# Altium schematic sheet 2-EXS82.SchDoc
size 594 x 420 mm; SheetNumber: 2; SheetTotal: 7; PageSetup: Record=PageOptions|CenterHorizontal=False|CenterVertical=False|PrintScale=0.43|XCorrection=0.00|YCorrection=0.00|PrintKind=1|BorderSize=5000000|LeftOffset=0|BottomOffset=0|Orientation=2|PaperLength=5940|PaperWidth=4200|Scale=100|PaperSource=7|PrintQuality=-4|MediaType=1|DitherType=10|PaperKind=Personal. 1: 215,9 x 279,4 mm|PrintScaleMode=0; NumTotalFolhas: 7; NumFolha: 2
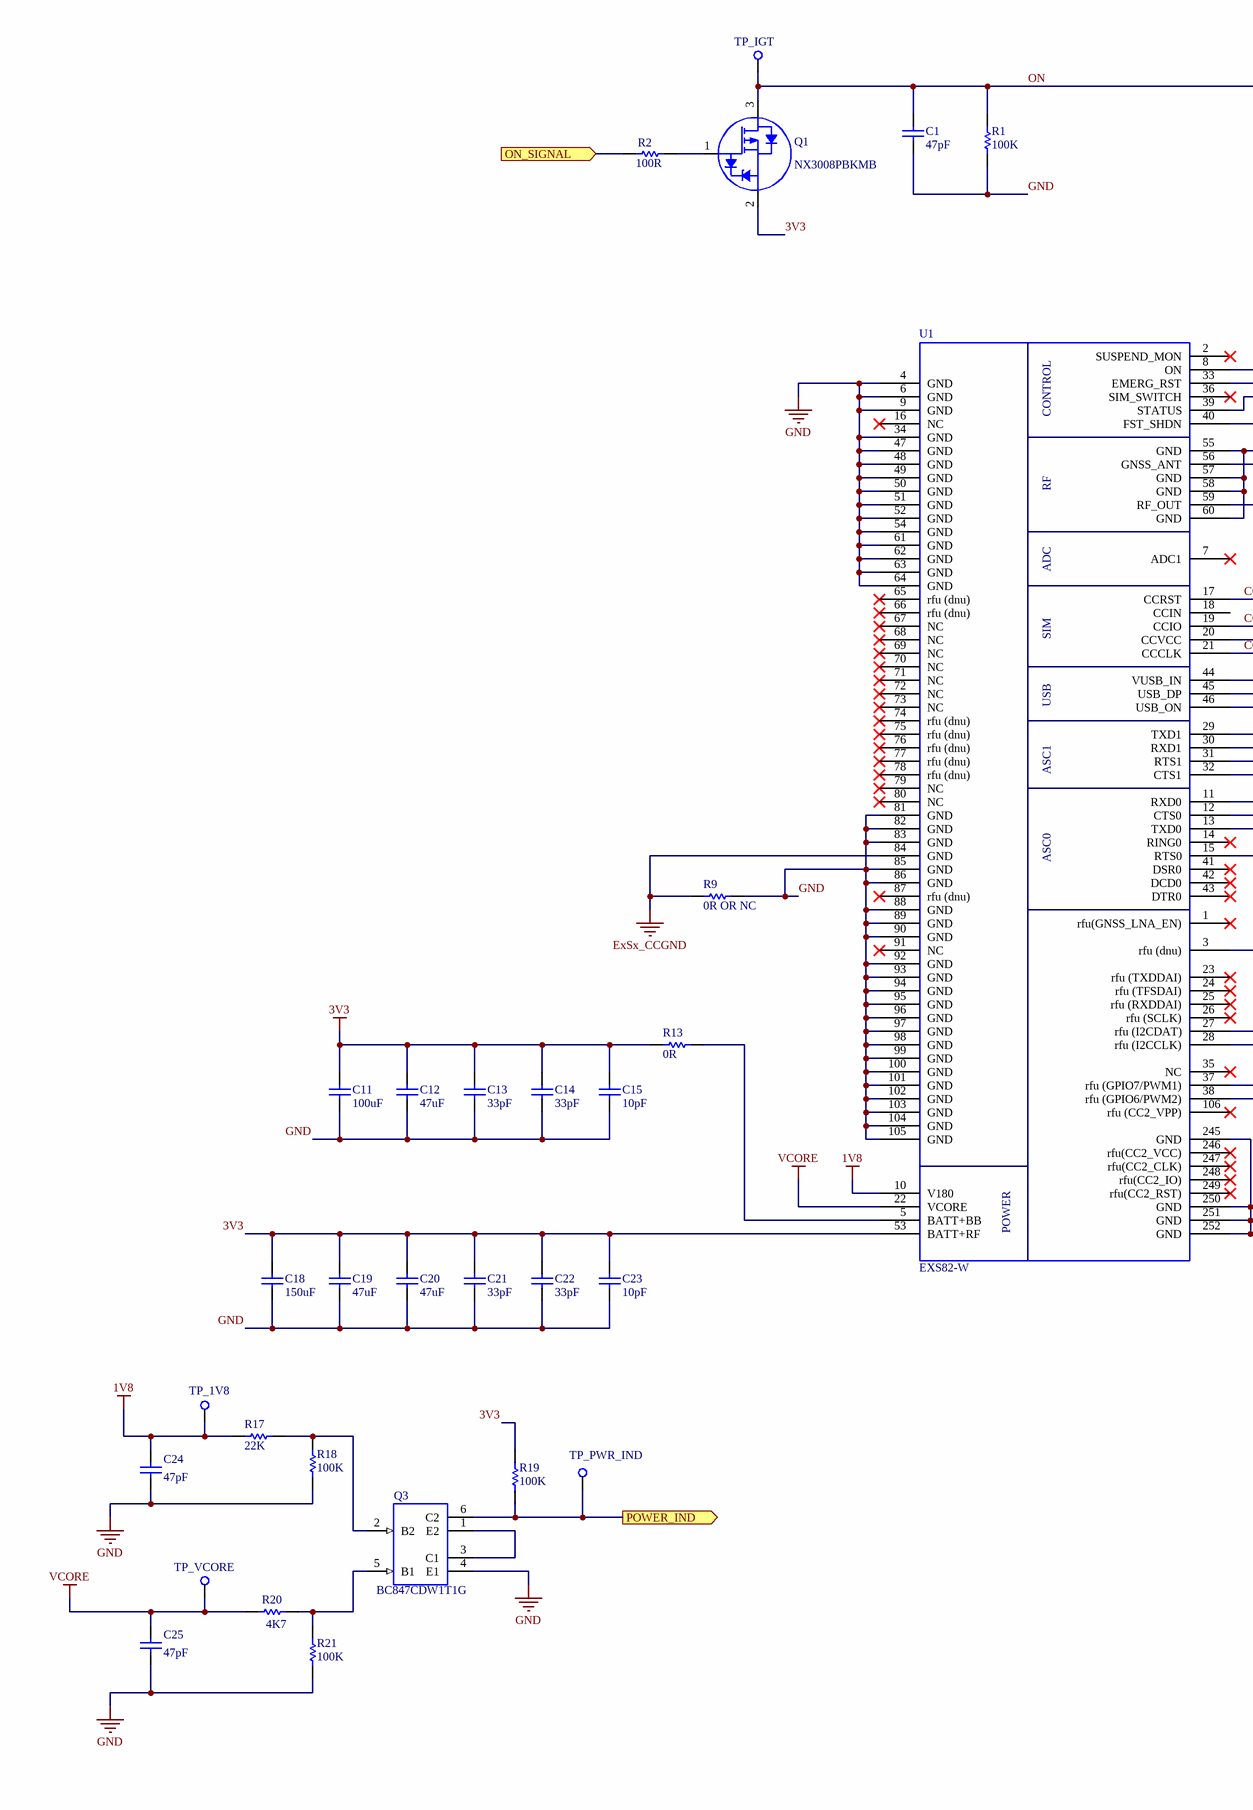
[diagram p0: 2-EXS82.SchDoc, left]
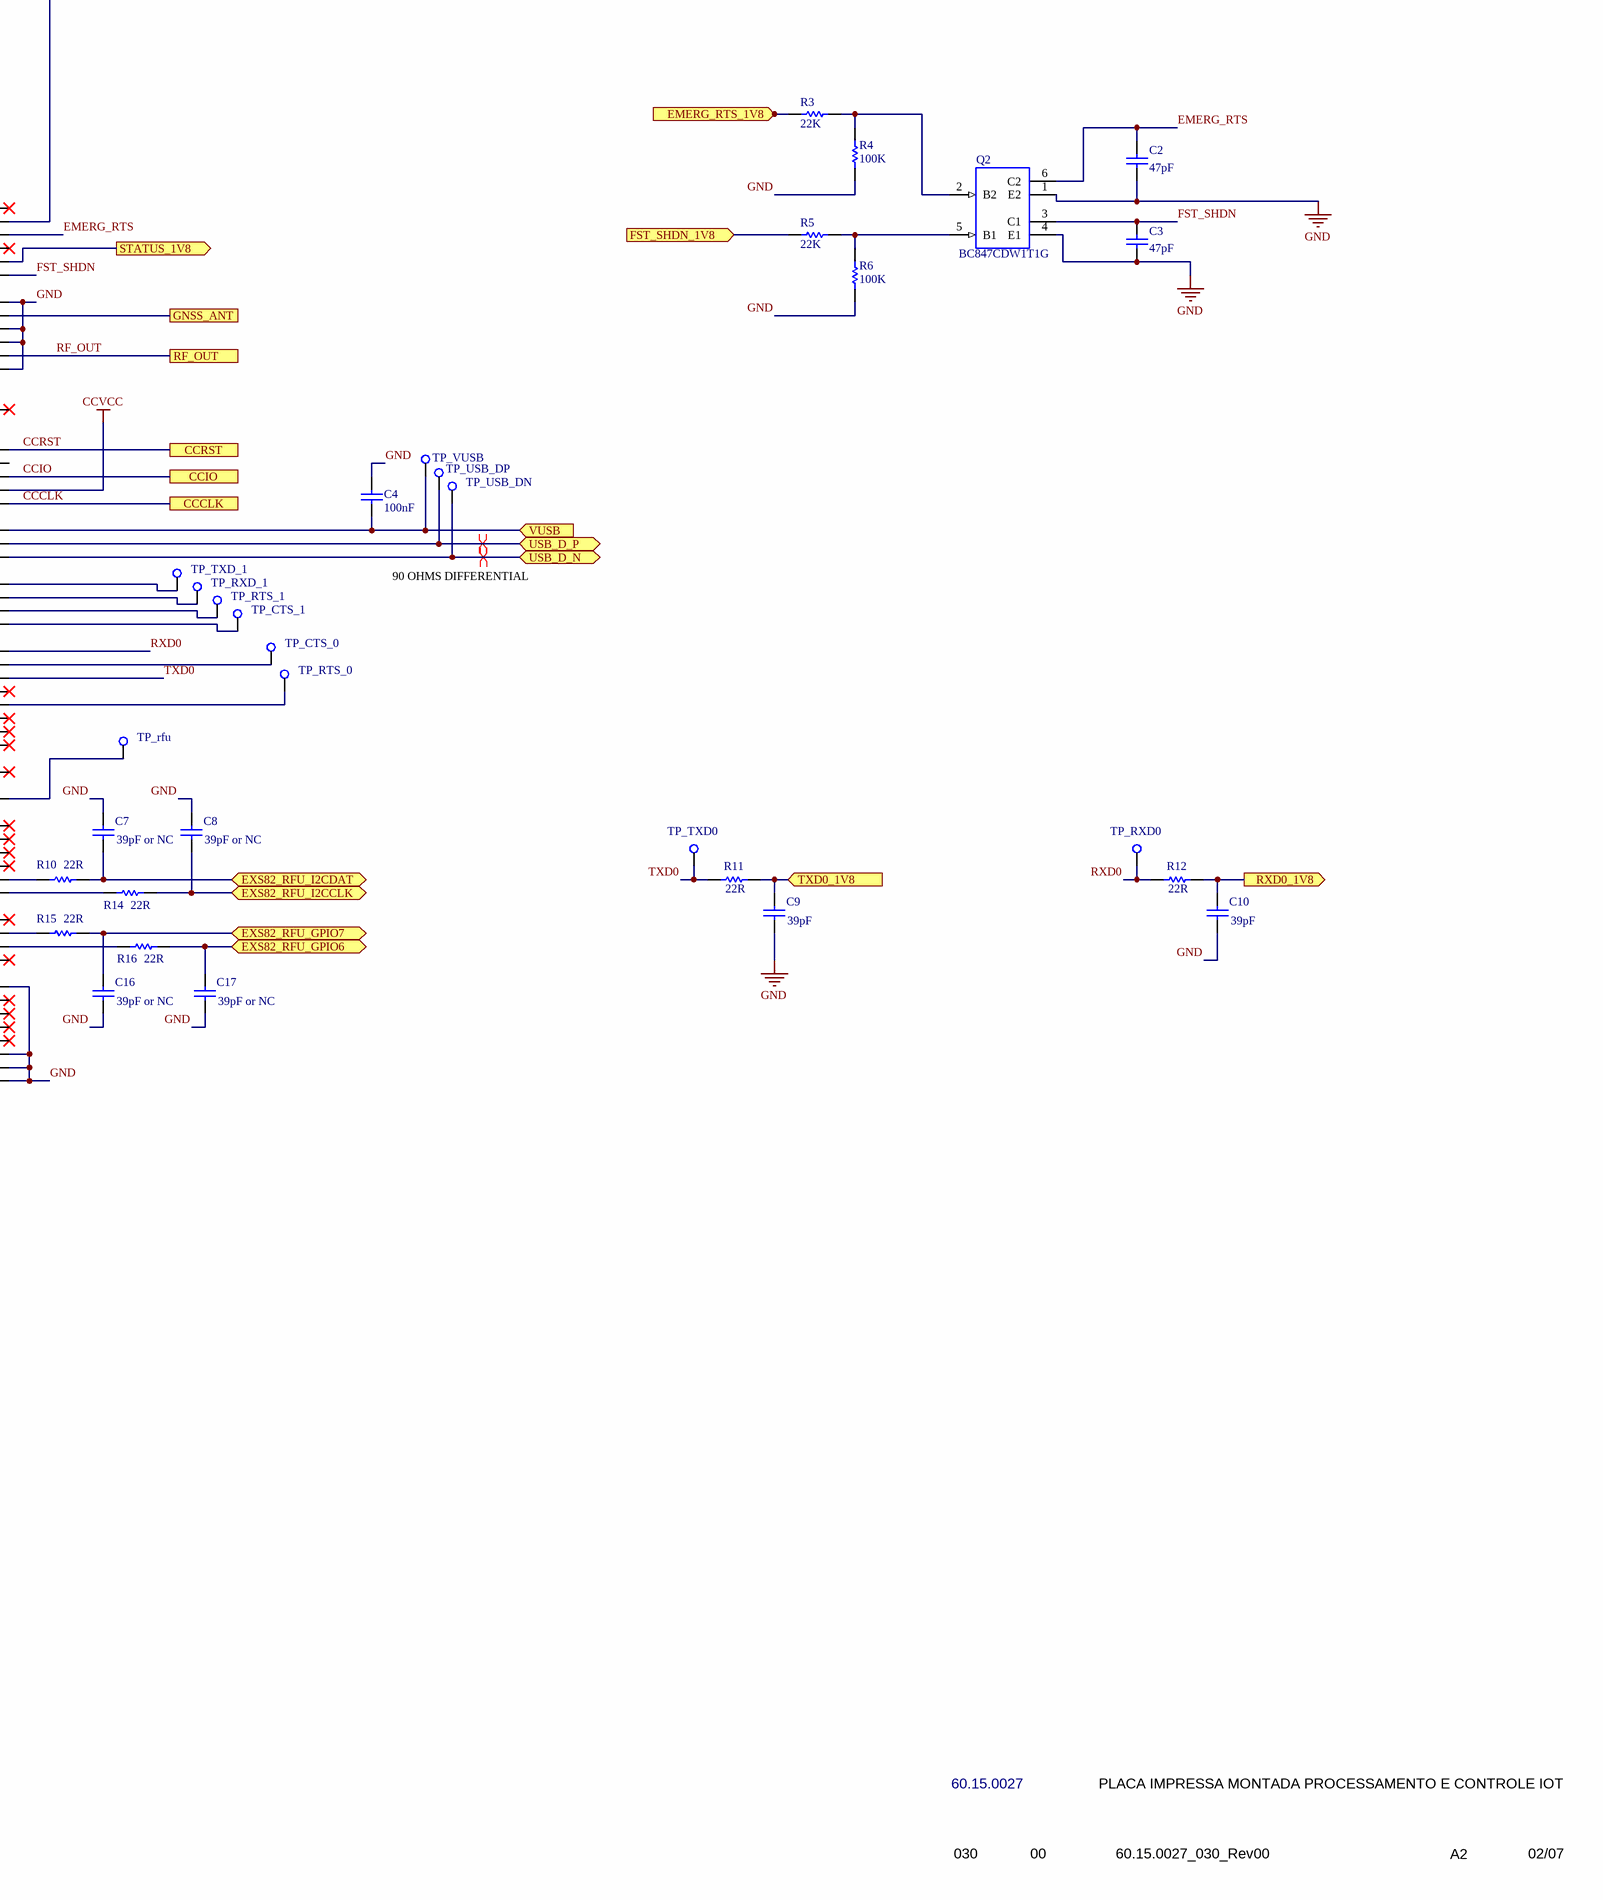
[diagram p1: 2-EXS82.SchDoc, right]

## Parts
C1  16.23.0798  [16.23.0798]  (value not drawn)
C2  16.23.0798  [16.23.0798]  (value not drawn)
C3  16.23.0798  [16.23.0798]  (value not drawn)
C4  16.23.0803  [16.23.0803]  (value not drawn)
C7  16.23.0802  [16.23.0802]  (value not drawn)
C8  16.23.0802  [16.23.0802]  (value not drawn)
C9  16.23.0802  [16.23.0802]  (value not drawn)
C10  16.23.0802  [16.23.0802]  (value not drawn)
C11  value 100uF  [16.23.0804]  (hidden comment: 16.23.0804)
C12  16.23.0795  [16.23.0795]  (value not drawn)
C13  16.23.0797  [16.23.0797]  (value not drawn)
C14  16.23.0797  [16.23.0797]  (value not drawn)
C15  16.23.0799  [16.23.0799]  (value not drawn)
C16  16.23.0802  [16.23.0802]  (value not drawn)
C17  16.23.0802  [16.23.0802]  (value not drawn)
C18  16.23.0789  [16.23.0789]  (value not drawn)
C19  16.23.0795  [16.23.0795]  (value not drawn)
C20  16.23.0795  [16.23.0795]  (value not drawn)
C21  16.23.0797  [16.23.0797]  (value not drawn)
C22  16.23.0797  [16.23.0797]  (value not drawn)
C23  16.23.0799  [16.23.0799]  (value not drawn)
C24  16.23.0798  [16.23.0798]  (value not drawn)
C25  16.23.0798  [16.23.0798]  (value not drawn)
Q1  72.19.0071  [72.19.0071]  (value not drawn)
Q2  72.26.0005  [72.26.0005]  (value not drawn)
Q3  72.26.0005  [72.26.0005]  (value not drawn)
R1  value 100K  [66.24.1346]  (hidden comment: 66.24.1346)
R2  value 100R  [66.24.1342]  (hidden comment: 66.24.1342)
R3  value 22K  [66.24.1344]  (hidden comment: 66.24.1344)
R4  value 100K  [66.24.1346]  (hidden comment: 66.24.1346)
R5  value 22K  [66.24.1344]  (hidden comment: 66.24.1344)
R6  value 100K  [66.24.1346]  (hidden comment: 66.24.1346)
R9  value 0R OR NC  [66.24.1337]  (hidden comment: 66.24.1337)
R10  value 22R  [66.24.1343]  (hidden comment: 66.24.1343)
R11  value 22R  [66.24.1343]  (hidden comment: 66.24.1343)
R12  value 22R  [66.24.1343]  (hidden comment: 66.24.1343)
R13  value 0R  [66.24.1337]  (hidden comment: 66.24.1337)
R14  value 22R  [66.24.1343]  (hidden comment: 66.24.1343)
R15  value 22R  [66.24.1343]  (hidden comment: 66.24.1343)
R16  value 22R  [66.24.1343]  (hidden comment: 66.24.1343)
R17  value 22K  [66.24.1344]  (hidden comment: 66.24.1344)
R18  value 100K  [66.24.1346]  (hidden comment: 66.24.1346)
R19  value 100K  [66.24.1346]  (hidden comment: 66.24.1346)
R20  value 4K7  [66.24.1345]  (hidden comment: 66.24.1345)
R21  value 100K  [66.24.1346]  (hidden comment: 66.24.1346)
TP_1V8  TESTPOINT  [TESTPOINT-60MILS]  (value not drawn)
TP_CTS_0  TESTPOINT  [TESTPOINT-60MILS]  (value not drawn)
TP_CTS_1  TESTPOINT  [TESTPOINT-60MILS]  (value not drawn)
TP_IGT  TESTPOINT  [TESTPOINT-60MILS]  (value not drawn)
TP_PWR_IND  TESTPOINT  [TESTPOINT-60MILS]  (value not drawn)
TP_rfu  TESTPOINT  [TESTPOINT-60MILS]  (value not drawn)
TP_RTS_0  TESTPOINT  [TESTPOINT-60MILS]  (value not drawn)
TP_RTS_1  TESTPOINT  [TESTPOINT-60MILS]  (value not drawn)
TP_RXD0  TESTPOINT  [TESTPOINT-60MILS]  (value not drawn)
TP_RXD_1  TESTPOINT  [TESTPOINT-60MILS]  (value not drawn)
TP_TXD0  TESTPOINT  [TESTPOINT-60MILS]  (value not drawn)
TP_TXD_1  TESTPOINT  [TESTPOINT-60MILS]  (value not drawn)
TP_USB_DN  TESTPOINT  [TESTPOINT-60MILS]  (value not drawn)
TP_USB_DP  TESTPOINT  [TESTPOINT-60MILS]  (value not drawn)
TP_VCORE  TESTPOINT  [TESTPOINT-60MILS]  (value not drawn)
TP_VUSB  TESTPOINT  [TESTPOINT-60MILS]  (value not drawn)
U1  value EXS82-W  [24.12.0081]  (hidden comment: 24.12.0081)

## Ports
CCCLK, CCIO, CCRST, EMERG_RTS_1V8 (in), EXS82_RFU_GPIO6 (bidir), EXS82_RFU_GPIO7 (bidir), EXS82_RFU_I2CCLK (bidir), EXS82_RFU_I2CDAT (bidir), FST_SHDN_1V8 (in), GNSS_ANT, ON_SIGNAL (in), POWER_IND (out), RF_OUT, RXD0_1V8 (out), STATUS_1V8 (out), TXD0_1V8 (in), USB_D_N (bidir), USB_D_P (bidir), VUSB (in)

## Nets
1V8: C24.2 R17.1 TP_1V8.1(TP) U1.10(V180)
3V3: C11.2 C12.1 C13.2 C14.2 C15.2 C18.1 C19.1 C20.1 C21.2 C22.2 C23.2 Q1.2(S) R13.1 R19.2 U1.53(BATT+RF)
CCVCC: U1.20(CCVCC)
ExSx_CCGND: R9.1 U1.84(GND)
GND: C1.1 C2.1 C3.1 C4.2 C7.2 C8.2 C9.1 C10.1 C11.1 C12.2 C13.1 C14.1 C15.1 C16.1 C17.1 C18.2 C19.2 C20.2 C21.1 C22.1 C23.1 C24.1 C25.1 Q2.1(E2) Q2.4(E1) Q3.4(E1) R1.1 R4.1 R6.1 R9.2 R18.1 R21.1 U1.4(GND) U1.6(GND) U1.9(GND) U1.34(GND) U1.47(GND) U1.48(GND) U1.49(GND) U1.50(GND) U1.51(GND) U1.52(GND) U1.54(GND) U1.55(GND) U1.57(GND) U1.58(GND) U1.60(GND) U1.61(GND) U1.62(GND) U1.63(GND) U1.64(GND) U1.81(GND) U1.82(GND) U1.83(GND) U1.85(GND) U1.86(GND) U1.88(GND) U1.89(GND) U1.90(GND) U1.92(GND) U1.93(GND) U1.94(GND) U1.95(GND) U1.96(GND) U1.97(GND) U1.98(GND) U1.99(GND) U1.100(GND) U1.101(GND) U1.102(GND) U1.103(GND) U1.104(GND) U1.105(GND) U1.245(GND) U1.250(GND) U1.251(GND) U1.252(GND)
VCORE: C25.2 R20.1 TP_VCORE.1(TP) U1.22(VCORE)
CCCLK: U1.21(CCCLK) ; port CCCLK
CCIO: U1.19(CCIO) ; port CCIO
CCRST: U1.17(CCRST) ; port CCRST
EMERG_RTS: C2.2 Q2.6(C2) U1.33(EMERG_RST)
EMERG_RTS_1V8: R3.1 ; port EMERG_RTS_1V8
EXS82_RFU_GPIO6: C17.2 R16.2 ; port EXS82_RFU_GPIO6
EXS82_RFU_GPIO7: C16.2 R15.2 ; port EXS82_RFU_GPIO7
EXS82_RFU_I2CCLK: C8.1 R14.2 ; port EXS82_RFU_I2CCLK
EXS82_RFU_I2CDAT: C7.1 R10.2 ; port EXS82_RFU_I2CDAT
FST_SHDN: C3.2 Q2.3(C1) U1.40(FST_SHDN)
FST_SHDN_1V8: R5.1 ; port FST_SHDN_1V8
GNSS_ANT: U1.56(GNSS_ANT) ; port GNSS_ANT
ON: C1.2 Q1.3(D) R1.2 TP_IGT.1(TP) U1.8(ON)
ON_SIGNAL: R2.1 ; port ON_SIGNAL
POWER_IND: Q3.6(C2) R19.1 TP_PWR_IND.1(TP) ; port POWER_IND
RF_OUT: U1.59(RF_OUT) ; port RF_OUT
RXD0: R12.1 TP_RXD0.1(TP) U1.11(RXD0)
RXD0_1V8: C10.2 R12.2 ; port RXD0_1V8
STATUS_1V8: U1.39(STATUS) ; port STATUS_1V8
TXD0: R11.1 TP_TXD0.1(TP) U1.13(TXD0)
TXD0_1V8: C9.2 R11.2 ; port TXD0_1V8
USB_D_N: TP_USB_DN.1(TP) U1.46(USB_ON) ; port USB_D_N
USB_D_P: TP_USB_DP.1(TP) U1.45(USB_DP) ; port USB_D_P
VUSB: C4.1 TP_VUSB.1(TP) U1.44(VUSB_IN) ; port VUSB
NetQ1_1: Q1.1(G) R2.2
NetQ2_2: Q2.2(B2) R3.2 R4.2
NetQ2_5: Q2.5(B1) R5.2 R6.2
NetQ3_1: Q3.1(E2) Q3.3(C1)
NetQ3_2: Q3.2(B2) R17.2 R18.2
NetQ3_5: Q3.5(B1) R20.2 R21.2
NetR10_1: R10.1 U1.27(rfu_(I2CDAT))
NetR13_2: R13.2 U1.5(BATT+BB)
NetR14_1: R14.1 U1.28(rfu_(I2CCLK))
NetR15_1: R15.1 U1.37(rfu_(GPIO7/PWM1))
NetR16_1: R16.1 U1.38(rfu_(GPIO6/PWM2))
NetTP_CTS_0_1: TP_CTS_0.1(TP) U1.12(CTS0)
NetTP_CTS_1_1: TP_CTS_1.1(TP) U1.32(CTS1)
NetTP_rfu_1: TP_rfu.1(TP) U1.3(rfu_(dnu))
NetTP_RTS_0_1: TP_RTS_0.1(TP) U1.15(RTS0)
NetTP_RTS_1_1: TP_RTS_1.1(TP) U1.31(RTS1)
NetTP_RXD_1_1: TP_RXD_1.1(TP) U1.30(RXD1)
NetTP_TXD_1_1: TP_TXD_1.1(TP) U1.29(TXD1)

Not connected (* = marked no-connect by the designer): U1 1(rfu(GNSS_LNA_EN))* 2(SUSPEND_MON)* 7(ADC1)* 14(RING0)* 16(NC)* 18(CCIN) 23(rfu_(TXDDAI))* 24(rfu_(TFSDAI))* 25(rfu_(RXDDAI))* 26(rfu_(SCLK))* 35(NC)* 36(SIM_SWITCH)* 41(DSR0)* 42(DCD0)* 43(DTR0)* 65(rfu_(dnu))* 66(rfu_(dnu))* 67(NC)* 68(NC)* 69(NC)* 70(NC)* 71(NC)* 72(NC)* 73(NC)* 74(rfu_(dnu))* 75(rfu_(dnu))* 76(rfu_(dnu))* 77(rfu_(dnu))* 78(rfu_(dnu))* 79(NC)* 80(NC)* 87(rfu_(dnu))* 91(NC)* 106(rfu_(CC2_VPP))* 246(rfu(CC2_VCC))* 247(rfu(CC2_CLK))* 248(rfu(CC2_IO))* 249(rfu(CC2_RST))*

## Layout directives
differential pair; rule Differential Pairs Routing [Pref Gap = 16mil    Min Gap  = 16mil    Max Gap  = 16milPref Width = 24.2mil    Min Width  = 24.2mil    Max Width  = 24.2mil]: USB_D_P
differential pair; rule Differential Pairs Routing [Pref Gap = 16mil    Min Gap  = 16mil    Max Gap  = 10milPref Width = 24.2mil    Min Width  = 24.2mil    Max Width  = 24.2mil]: USB_D_N

## Notes on the sheet
- 90 OHMS DIFFERENTIAL
- 60.15.0027
- PLACA IMPRESSA MONTADA PROCESSAMENTO E CONTROLE IOT
- 030
- 00
- 60.15.0027_030_Rev00
- A2
- 02/07
- 1
- 2
- 3
- 4
- 5
- 6
- 7
- 8
- A
- B
- C
- D
- E
- F
- G
- H
- DOCUMENTO DE ENGENHARIA DE PRODUTO
- DOCUMENT OF PRODUCT ENGINEERING
- CÓDIGO / CODE
- DESCRIÇÃO / DESCRIPTION
- DOC
- REV
- ARQUIVO / FILE
- FORM./SIZE
- FOLHA / PAGE
- (in symbol 16.23.0789) 150uF
- (in symbol 16.23.0795) 47uF
- (in symbol 16.23.0797) 33pF
- (in symbol 16.23.0798) 47pF
- (in symbol 16.23.0799) 10pF
- (in symbol 16.23.0802) 39pF or NC; 39pF
- (in symbol 16.23.0803) 100nF
- (in symbol 24.12.0081) CONTROL; RF; ADC; SIM; USB; ASC1; ASC0; POWER
- (in symbol 72.19.0071) NX3008PBKMB
- (in symbol 72.26.0005) BC847CDW1T1G

## Library data of the parts
C1-C3 C24 C25 = 16.23.0798: CAPACITOR CERAMICO 47pF 10V 5% C0G SMD 0201
C4 = 16.23.0803: CAPACITOR CERAMICO 100nF 16V 10%% X5R SMD 0201
C7-C10 C16 C17 = 16.23.0802: CAPACITOR CERAMICO 39pF 100V 5% C0G SMD 0201
C11 = 16.23.0804: CAPACITOR CERAMICO 100uF 6.3V 10%% X5R SMD 1206
C12 C19 C20 = 16.23.0795: CERAMICO 47uF 10% 6.3V X5R SMD 1206
C13 C14 C21 C22 = 16.23.0797: CAPACITOR CERAMICO 33pF 10V 5% C0G SMD 0201
C15 C23 = 16.23.0799: CAPACITOR CERAMICO 10pF 25V 5% C0G SMD 0201
C18 = 16.23.0789: CAPACITOR CERAMICO 150uF 20% 6.3V X5R SMD 1206
Q1 = 72.19.0071: MOSFET CANAL P SMD 30V 230mA SOT883B
Q2 Q3 = 72.26.0005: TRANSISTOR DUPLO NPN BC847 SMD SOT363
R1 R4 R6 R18 R19 R21 = 66.24.1346: RESISTOR THICK FILM 50mW 100K OHMS 1% SMD 0201
R2 = 66.24.1342: RESISTOR THICK FILM 50mW 100 OHMS 1% SMD 0201
R3 R5 R17 = 66.24.1344: RESISTOR THICK FILM 50mW 22K OHMS 1% SMD 0201
R9 R13 = 66.24.1337: RESISTOR THICK FILM 0,1W 0 OHMS SMD 0603
R10-R12 R14-R16 = 66.24.1343: RESISTOR THICK FILM 50mW 22 OHMS 1% SMD 0201
R20 = 66.24.1345: RESISTOR THICK FILM 50mW 4K7 OHMS 1% SMD 0201
TP_1V8 TP_CTS_0 TP_CTS_1 TP_IGT TP_PWR_IND TP_rfu TP_RTS_0 TP_RTS_1 TP_RXD0 TP_RXD_1 TP_TXD0 TP_TXD_1 TP_USB_DN TP_USB_DP TP_VCORE TP_VUSB = TESTPOINT-60MILS: PONTO DE TESTE PARA CAMA DE PREGO
U1 = 24.12.0081: CIRCUITO INTEGRADO DIG MOD COMUNICACAO MULTI REDES EXS82-W